# EasyEDA schematic 1-Schematic_LoRaRice_node3.json
TITLE: LoRaRRice_node3; REV: 1.0; Date: 2023-12-11; Sheet: 1/1; Drawn By: jack12688; Company: 64346CPE
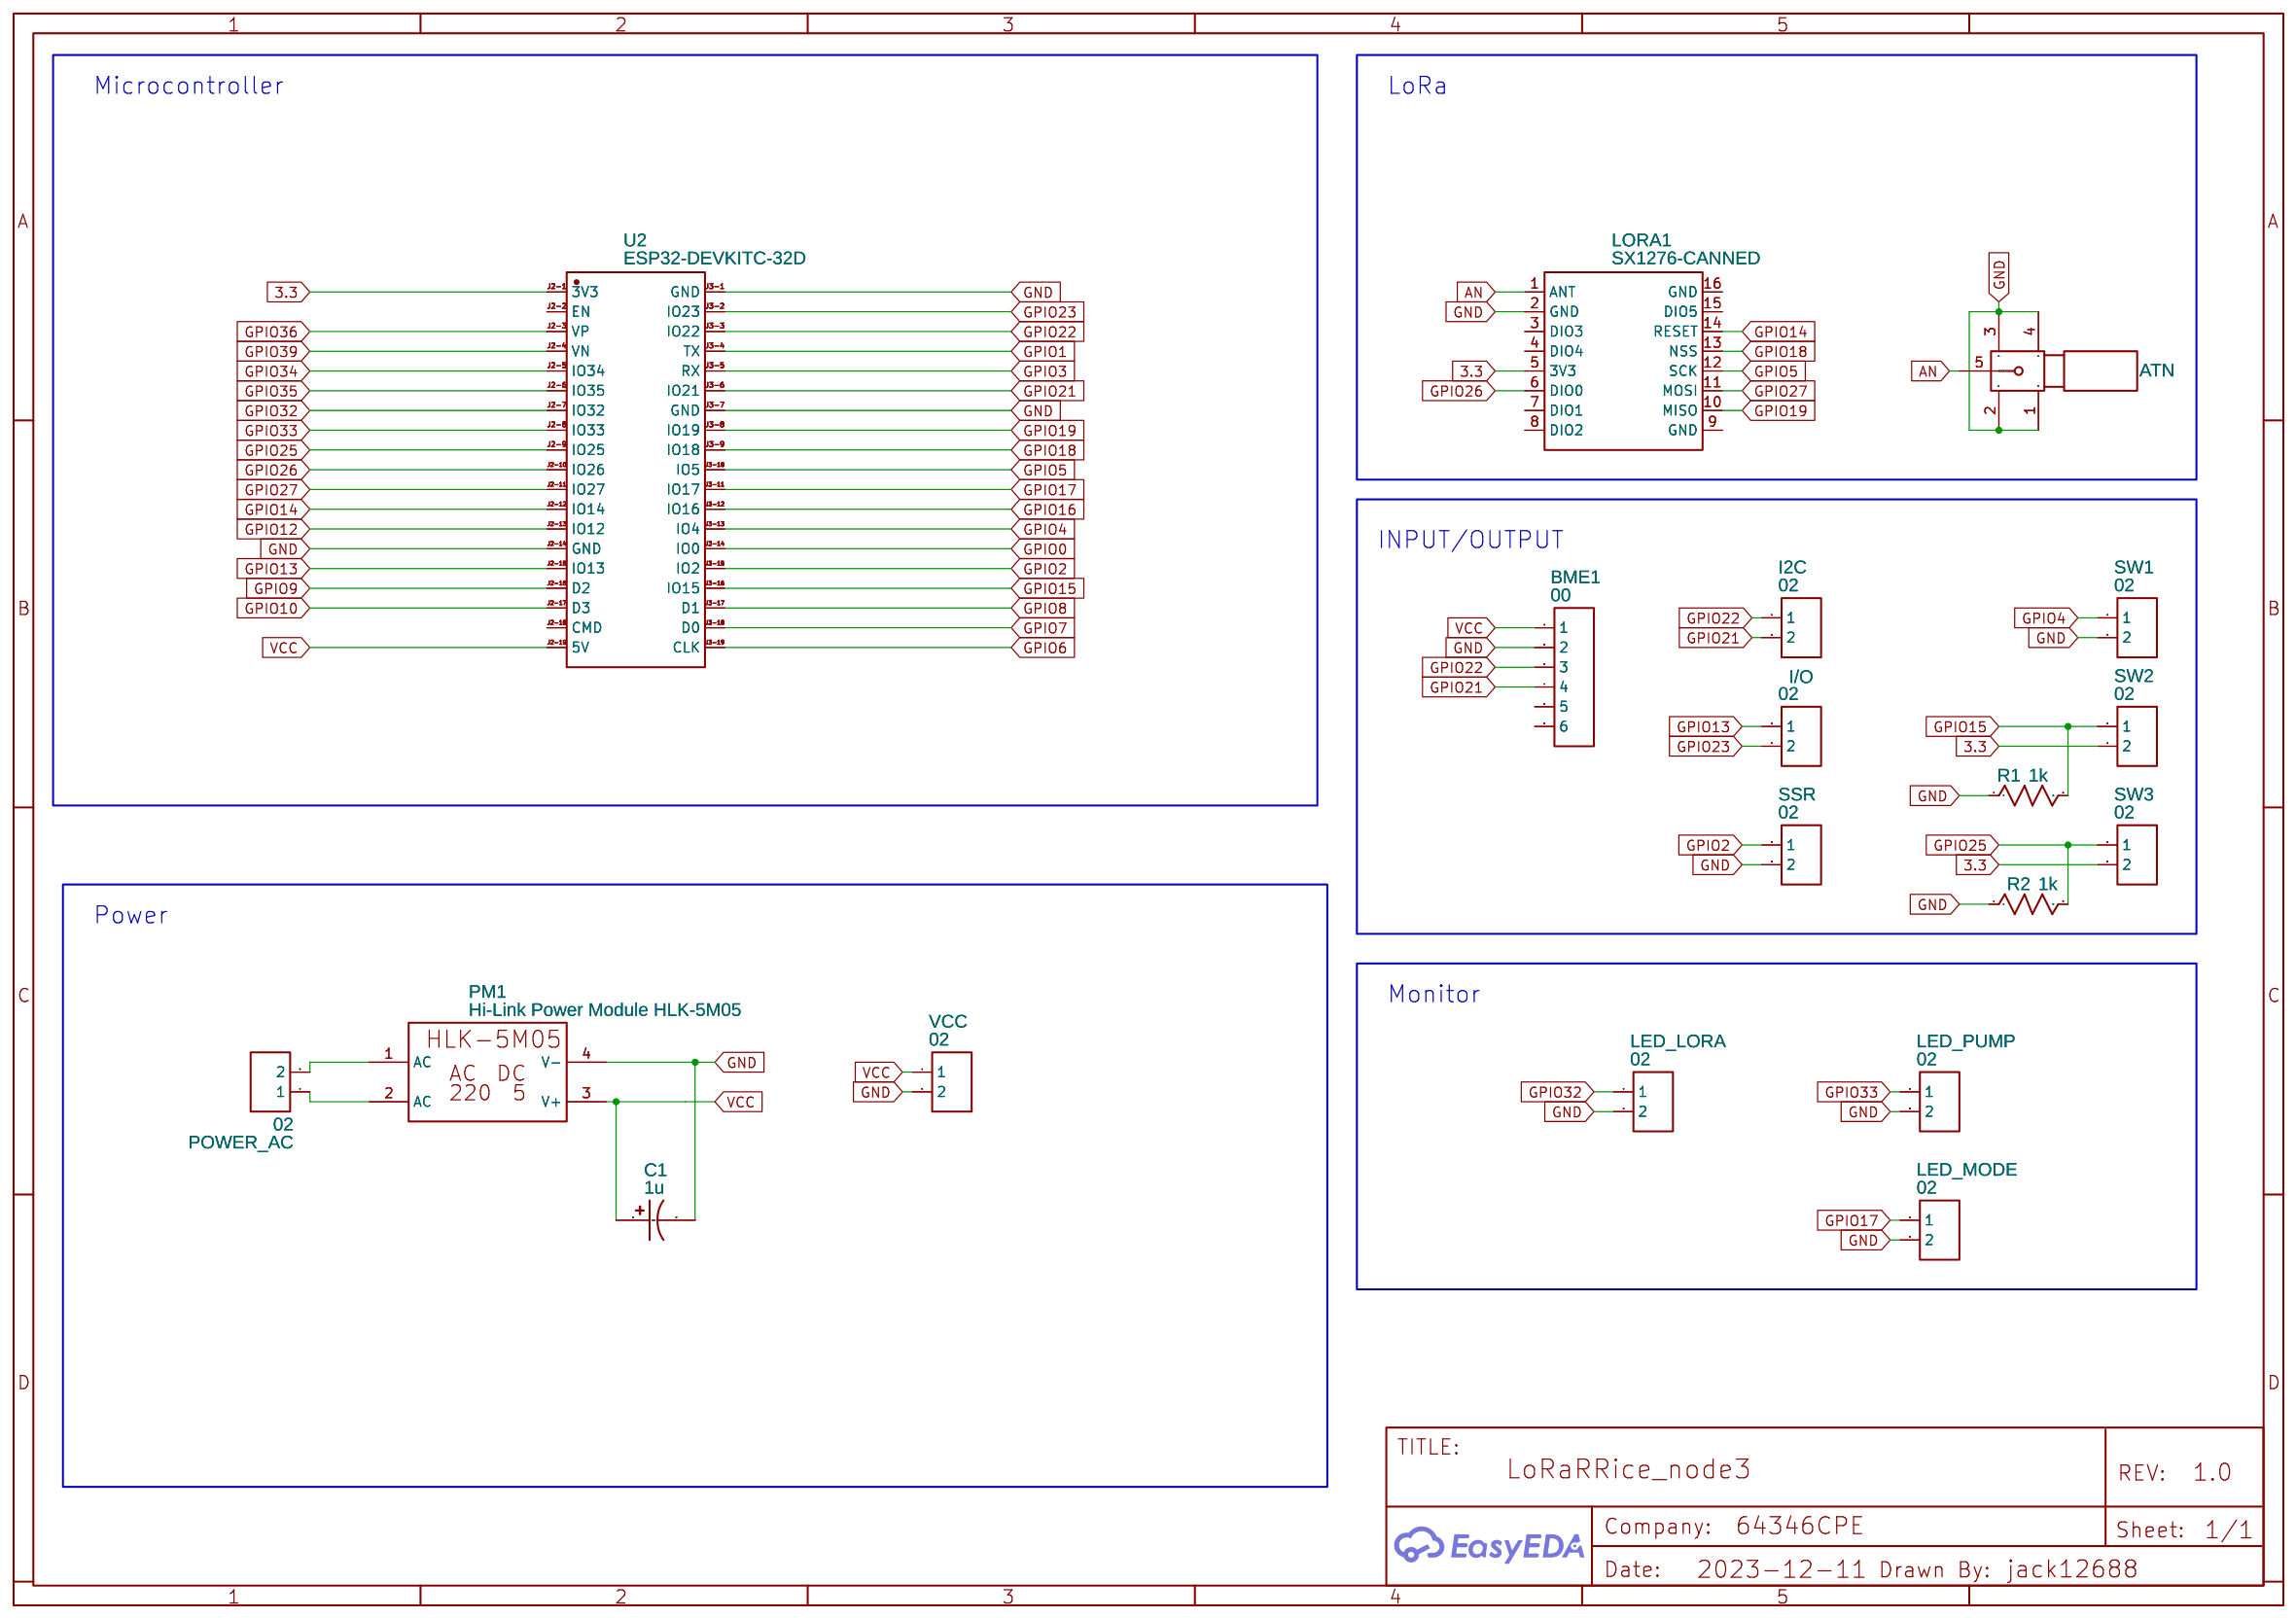
[diagram p0: schematic sheet]

## Parts
BME1  00  [HDR-F-2.54_1X6]
C1  1u  [CAP-D4.0×F1.5]
I2C  02  [CONN-TH_2P-P5.00]
I/O  02  [CONN-TH_2P-P5.00]
LED_LORA  02  [CONN-TH_2P-P5.00]
LED_MODE  02  [CONN-TH_2P-P5.00]
LED_PUMP  02  [CONN-TH_2P-P5.00]
LORA1  SX1276-CANNED  [SX1276-CANNED]
PM1  Hi-Link Power Module HLK-5M05  [HLK_5M05]
POWER_AC  02  [CONN-TH_2P-P5.00]
R1  1k  [R_AXIAL-0.4]
R2  1k  [R_AXIAL-0.4]
RF1  ATN  [SMA-SMD_BWSMA-KE-P001]
SSR  02  [CONN-TH_2P-P5.00]
SW1  02  [CONN-TH_2P-P5.00]
SW2  02  [CONN-TH_2P-P5.00]
SW3  02  [CONN-TH_2P-P5.00]
U2  ESP32-DEVKITC-32D  [COMM-SMD_ESP32-DEVKITC-32D]
VCC  02  [CONN-TH_2P-P5.00]

## Library data of the parts
BME1 = HDR-F-2.54_1x6: Supplier Part: C40877; Supplier: LCSC; Contributor: LCEDA_Lib
C1 = CE_TH_D4.0×F1.5_US: Contributor: LCEDA_Lib
I2C I/O LED_LORA LED_MODE LED_PUMP POWER_AC SSR SW1-SW3 VCC = CONN-TH_2P-P5.00: Supplier: LCSC; Contributor: LCEDA_Lib
LORA1 = SX1276-CANNED: Manufacturer: G-NiceRF; Manufacturer Part: LoRa1276-C1; Supplier: Banggood; Supplier Part: Unknown; link: https://uk.banggood.com/LoRa1276-C1-SX1276-868MHz-LoRa-Module-Remote-Spread-Spectrum-Wireless-Module-20dBm-100mW-3-5KM-p-1416393.html?gmcCountry=GB¤cy=GBP&createTmp=1&utm_source=googleshopping&utm_medium=cpc_bgcs&utm_content=garman&utm_campaign=pla-gbg-ele-pc&gclid=EAIaIQobChMIouzku5XS4gIVipTtCh1cvgo9EAYYByABEgJIPfD_BwE&cur_warehouse=CN; Contributor: P-Thomsen
PM1 = Hi-Link Power Module HLK-5M05: Manufacturer: Hi-Link; Manufacturer Part: HLK-5M05; Contributor: dbrancam
R1 R2 = R_AXIAL-0.4_US: Contributor: LCEDA_Lib
RF1 = BWSMA-KE-P001: Contributor: LCSC; Supplier: LCSC; Supplier Part: C496550; Manufacturer: BAT WIRELESS(蝙蝠无线); JLCPCB Part Class: Extended Part
U2 = ESP32-DEVKITC-32D: Supplier: LCSC; Supplier Part: C571181; Manufacturer: ESPRESSIF(乐鑫); Manufacturer Part: ESP32-DevKitC-32D; JLCPCB Part Class: Extended Part; Contributor: lcsc

## Nets
GND: BME1.2 C1.2 LED_LORA.2 LED_MODE.2 LED_PUMP.2 LORA1.2(GND) PM1.4(V-) R1.1 R2.1 RF1.1 RF1.2 RF1.3 RF1.4 SSR.2 SW1.2 U2.J2-14(GND) U2.J3-1(GND) U2.J3-7(GND) VCC.2
VCC: BME1.1 C1.1 PM1.3(V+) U2.J2-19(5V) VCC.1
3.3: LORA1.5(3V3) SW2.2 SW3.2 U2.J2-1(3V3)
AN: LORA1.1(ANT) RF1.5
GPIO0: U2.J3-14(IO0)
GPIO1: U2.J3-4(TX)
GPIO2: SSR.1 U2.J3-15(IO2)
GPIO3: U2.J3-5(RX)
GPIO4: SW1.1 U2.J3-13(IO4)
GPIO5: LORA1.12(SCK) U2.J3-10(IO5)
GPIO6: U2.J3-19(CLK)
GPIO7: U2.J3-18(D0)
GPIO8: U2.J3-17(D1)
GPIO9: U2.J2-16(D2)
GPIO10: U2.J2-17(D3)
GPIO12: U2.J2-13(IO12)
GPIO13: I/O.1 U2.J2-15(IO13)
GPIO14: LORA1.14(RESET) U2.J2-12(IO14)
GPIO15: R1.2 SW2.1 U2.J3-16(IO15)
GPIO16: U2.J3-12(IO16)
GPIO17: LED_MODE.1 U2.J3-11(IO17)
GPIO18: LORA1.13(NSS) U2.J3-9(IO18)
GPIO19: LORA1.10(MISO) U2.J3-8(IO19)
GPIO21: BME1.4 I2C.2 U2.J3-6(IO21)
GPIO22: BME1.3 I2C.1 U2.J3-3(IO22)
GPIO23: I/O.2 U2.J3-2(IO23)
GPIO25: R2.2 SW3.1 U2.J2-9(IO25)
GPIO26: LORA1.6(DIO0) U2.J2-10(IO26)
GPIO27: LORA1.11(MOSI) U2.J2-11(IO27)
GPIO32: LED_LORA.1 U2.J2-7(IO32)
GPIO33: LED_PUMP.1 U2.J2-8(IO33)
GPIO34: U2.J2-5(IO34)
GPIO35: U2.J2-6(IO35)
GPIO36: U2.J2-3(VP)
GPIO39: U2.J2-4(VN)
Net-(PM1-1): PM1.1(AC) POWER_AC.2
Net-(PM1-2): PM1.2(AC) POWER_AC.1

Not connected (* = marked no-connect by the designer): BME1 5 6; LORA1 3(DIO3) 4(DIO4) 7(DIO1) 8(DIO2) 9(GND) 15(DIO5) 16(GND); U2 J2-2(EN) J2-18(CMD)

## Notes on the sheet
- Microcontroller
- LoRa
- INPUT/OUTPUT
- Power
- Monitor
